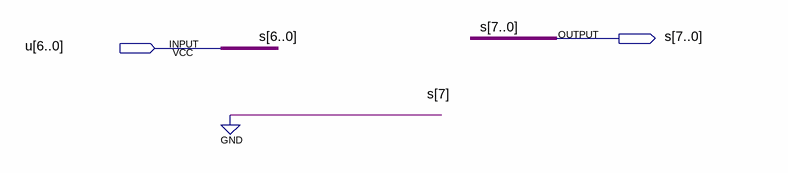
[diagram p0: schematic sheet]
// Quartus schematic zeroExtend7to8.bdf as structural Verilog: 0 symbols, 2 pins
module zeroExtend7to8 (
  input  [6:0] u,
  output [7:0] s
);


  assign s = {1'b0, u};
endmodule
